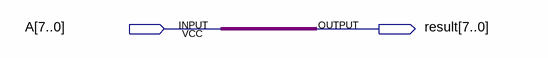
[diagram p0: schematic sheet]
// Quartus schematic ALU_set.bdf as structural Verilog: 0 symbols, 2 pins
module ALU_set (
  input  [7:0] A,
  output [7:0] result
);


  assign result = A;
endmodule
